# Altium project BMS_rev3.PrjPCB (part 1 of 3)
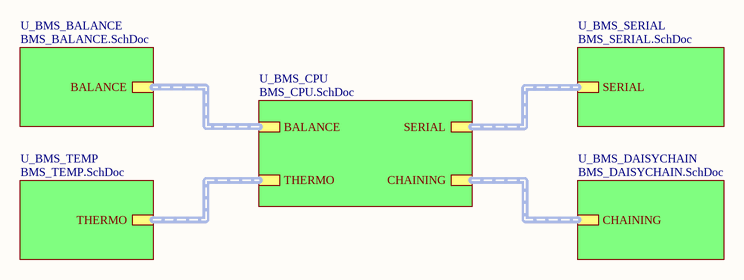
[diagram p0: BMS_REV3.SchDoc]
7 sheets, 203 parts. Net scope: hierarchical (ports join the sheet entries above them; power ports are global).
Board file: PCB_REV3.PcbDoc
Sheets:
  BMS_REV3.SchDoc
    U_BMS_BALANCE = BMS_BALANCE.SchDoc
      8 = BMS_VSNS.SchDoc
      7 = BMS_VSNS.SchDoc
      6 = BMS_VSNS.SchDoc
      5 = BMS_VSNS.SchDoc
      4 = BMS_VSNS.SchDoc
      3 = BMS_VSNS.SchDoc
      2 = BMS_VSNS.SchDoc
      1 = BMS_VSNS.SchDoc
      9 = BMS_VSNS.SchDoc
      11 = BMS_VSNS.SchDoc
      10 = BMS_VSNS.SchDoc
      12 = BMS_VSNS.SchDoc
    U_BMS_CPU = BMS_CPU.SchDoc
    U_BMS_DAISYCHAIN = BMS_DAISYCHAIN.SchDoc
    U_BMS_TEMP = BMS_TEMP.SchDoc
    U_BMS_SERIAL = BMS_SERIAL.SchDoc

## Sheet BMS_REV3.SchDoc
size B; Organization: Altium Limited; Address1: L3, 12a Rodborough Rd; Address2: Frenchs Forest; Address3: NSW; Address4: Australia 2086

### Sub-sheets
U_BMS_BALANCE = BMS_BALANCE.SchDoc: BALANCE (harness BALANCE)
U_BMS_CPU = BMS_CPU.SchDoc: SERIAL (harness SERIAL), CHAINING (harness CHAINING), THERMO (harness THERMO), BALANCE (harness BALANCE)
U_BMS_DAISYCHAIN = BMS_DAISYCHAIN.SchDoc: CHAINING (harness CHAINING)
U_BMS_SERIAL = BMS_SERIAL.SchDoc: SERIAL (harness SERIAL)
U_BMS_TEMP = BMS_TEMP.SchDoc: THERMO (harness THERMO)

### Buses and harness runs
harness sheet U_BMS_BALANCE/BALANCE = sheet U_BMS_CPU/BALANCE
harness sheet U_BMS_CPU/CHAINING = sheet U_BMS_DAISYCHAIN/CHAINING
harness sheet U_BMS_CPU/SERIAL = sheet U_BMS_SERIAL/SERIAL
harness sheet U_BMS_CPU/THERMO = sheet U_BMS_TEMP/THERMO

### Notes on the sheet
- Title
- Size:
- Date:
- Tabloid
- Number:
- Time:
- Revision:
- Sheet
- of
- File:

## Sheet BMS_BALANCE.SchDoc
size B; Organization: Altium Limited; Address1: L3, 12a Rodborough Rd; Address2: Frenchs Forest; Address3: NSW; Address4: Australia 2086
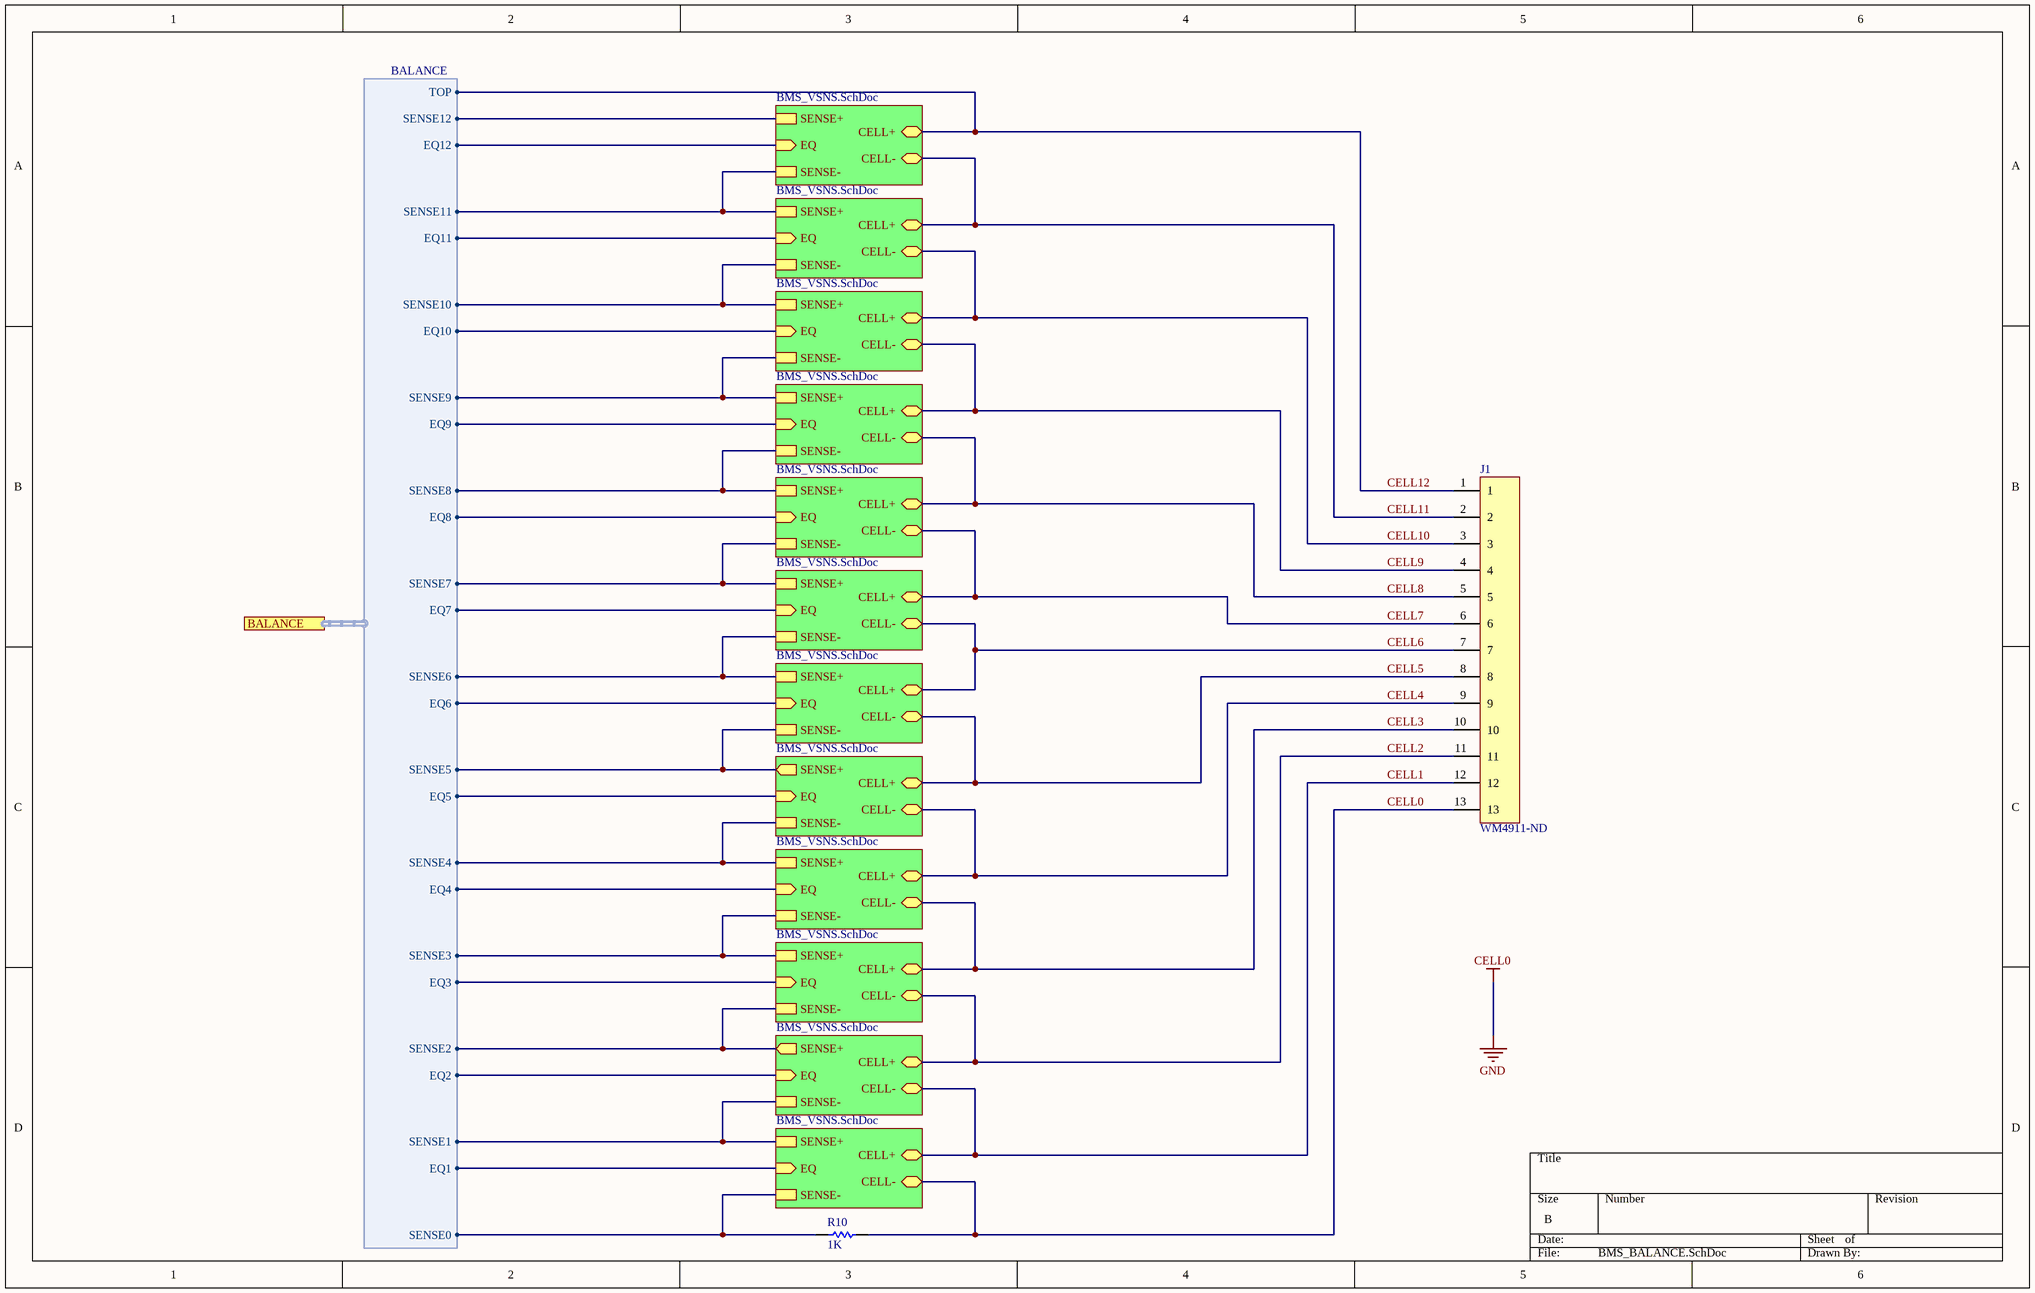
[diagram p1: BMS_BALANCE.SchDoc]

### Parts
J1  WM4911-ND  [13PIN]
R10  1K  [RES-0603]

### Sub-sheets
1 = BMS_VSNS.SchDoc: EQ (in), SENSE+, SENSE-, CELL+ (bidir), CELL- (bidir)
2 = BMS_VSNS.SchDoc: EQ (in), SENSE+ (out), SENSE-, CELL+ (bidir), CELL- (bidir)
3 = BMS_VSNS.SchDoc: EQ (in), SENSE+, SENSE-, CELL+ (bidir), CELL- (bidir)
4 = BMS_VSNS.SchDoc: EQ (in), SENSE+, SENSE-, CELL+ (bidir), CELL- (bidir)
5 = BMS_VSNS.SchDoc: EQ (in), SENSE+ (out), SENSE-, CELL+ (bidir), CELL- (bidir)
6 = BMS_VSNS.SchDoc: EQ (in), SENSE+, SENSE-, CELL+ (bidir), CELL- (bidir)
7 = BMS_VSNS.SchDoc: EQ (in), SENSE+, SENSE-, CELL+ (bidir), CELL- (bidir)
8 = BMS_VSNS.SchDoc: EQ (in), SENSE+, SENSE-, CELL+ (bidir), CELL- (bidir)
9 = BMS_VSNS.SchDoc: EQ (in), SENSE+, SENSE-, CELL+ (bidir), CELL- (bidir)
10 = BMS_VSNS.SchDoc: EQ (in), SENSE+, SENSE-, CELL+ (bidir), CELL- (bidir)
11 = BMS_VSNS.SchDoc: EQ (in), SENSE+, SENSE-, CELL+ (bidir), CELL- (bidir)
12 = BMS_VSNS.SchDoc: EQ (in), SENSE+, SENSE-, CELL+ (bidir), CELL- (bidir)

### Ports
BALANCE (harness BALANCE)

### Harnesses
BALANCE: EQ6, SENSE6, EQ7, SENSE7, EQ8, SENSE8, EQ9, SENSE9, SENSE5, EQ5, SENSE4, EQ4, SENSE3, EQ3, SENSE2, EQ2, SENSE1, EQ1, SENSE0, SENSE10, EQ10, TOP, EQ11, SENSE11, SENSE12, EQ12

### Nets
CELL0: J1.13 R10.2 ; sheet 1/CELL-  [also labelled GND]
CELL1: J1.12 ; sheet 2/CELL-, sheet 1/CELL+
CELL2: J1.11 ; sheet 3/CELL-, sheet 2/CELL+
CELL3: J1.10 ; sheet 4/CELL-, sheet 3/CELL+
CELL4: J1.9 ; sheet 5/CELL-, sheet 4/CELL+
CELL5: J1.8 ; sheet 6/CELL-, sheet 5/CELL+
CELL6: J1.7 ; sheet 7/CELL-, sheet 6/CELL+
CELL7: J1.6 ; sheet 8/CELL-, sheet 7/CELL+
CELL8: J1.5 ; sheet 8/CELL+, sheet 9/CELL-
CELL9: J1.4 ; sheet 9/CELL+, sheet 10/CELL-
CELL10: J1.3 ; sheet 11/CELL-, sheet 10/CELL+
CELL11: J1.2 ; sheet 11/CELL+, sheet 12/CELL-
CELL12: J1.1 ; sheet 12/CELL+, port BALANCE.TOP
EQ-1: sheet 1/EQ, port BALANCE.EQ1
EQ-2: sheet 2/EQ, port BALANCE.EQ2
EQ-3: sheet 3/EQ, port BALANCE.EQ3
EQ-4: sheet 4/EQ, port BALANCE.EQ4
EQ-5: sheet 5/EQ, port BALANCE.EQ5
EQ-6: sheet 6/EQ, port BALANCE.EQ6
EQ-7: sheet 7/EQ, port BALANCE.EQ7
EQ-8: sheet 8/EQ, port BALANCE.EQ8
EQ-9: sheet 9/EQ, port BALANCE.EQ9
EQ-10: sheet 10/EQ, port BALANCE.EQ10
EQ-11: sheet 11/EQ, port BALANCE.EQ11
EQ-12: sheet 12/EQ, port BALANCE.EQ12
VSNS0: R10.1 ; sheet 1/SENSE-, port BALANCE.SENSE0
VSNS1: sheet 2/SENSE-, sheet 1/SENSE+, port BALANCE.SENSE1
VSNS2: sheet 3/SENSE-, sheet 2/SENSE+, port BALANCE.SENSE2
VSNS3: sheet 4/SENSE-, sheet 3/SENSE+, port BALANCE.SENSE3
VSNS4: sheet 5/SENSE-, sheet 4/SENSE+, port BALANCE.SENSE4
VSNS5: sheet 6/SENSE-, sheet 5/SENSE+, port BALANCE.SENSE5
VSNS6: sheet 7/SENSE-, sheet 6/SENSE+, port BALANCE.SENSE6
VSNS7: sheet 8/SENSE-, sheet 7/SENSE+, port BALANCE.SENSE7
VSNS8: sheet 8/SENSE+, sheet 9/SENSE-, port BALANCE.SENSE8
VSNS9: sheet 9/SENSE+, sheet 10/SENSE-, port BALANCE.SENSE9
VSNS10: sheet 11/SENSE-, sheet 10/SENSE+, port BALANCE.SENSE10
VSNS11: sheet 11/SENSE+, sheet 12/SENSE-, port BALANCE.SENSE11
VSNS12: sheet 12/SENSE+, port BALANCE.SENSE12

### Notes on the sheet
- Title
- Size:
- Date:
- Tabloid
- Number:
- Time:
- Revision:
- Sheet
- of
- File:

### Library data of the parts
J1 = 13PIN: CONN HEADER R/A 13POS 2.54MM; Manufacturer: Molex; Manufacturer Part Number: 0705530012; Contact Resistance: 30mR; Number of Positions: 13; Gender: Male; Connector Type: Male Pin; Pitch: 0.1inch; Supplier 1: Digi-Key; Stock 1: 22; Pricing 1: 1=6.09, 10=5.355, 100=4.2597, 1000=3.52944 (USD); Mount: Through Hole; Contact Material: Bronze; Contact Plating: Gold; Housing Color: Black; Housing Material: Polyester; Color: Black; Min Operating Temperature: -40°C; Max Operating Temperature: 105°C; Package Quantity: 1; Packaging: Rail/Tube; Number of Rows: 1; Termination: Solder; Orientation: Right Angle; Length: 35.57mm; Contact Mating Length: 0.24inch; Depth: 13.59mm; Supplier Part Number 1: WM4911-ND
R10 = 0603-1KR: RES SMD 1K OHM 1% 1/10W 0603; Manufacturer: Vishay Dale; Manufacturer Part Number: CRCW06031K00FKEA; Resistance: 1kR; Power Rating: 100mW; Voltage Rating: 75V; Temperature Coefficient: 100ppm/°C; Supplier 1: Digi-Key; Stock 1: 671453; Pricing 1: 1=0.1, 10=0.034, 100=0.0139, 1000=0.00623, 2500=0.0054 (USD); Mount: Surface Mount; Case/Package: 0603; Number of Pins: 2; Weight: 7.1E-05oz; Case Code (Metric): 1608; Case Code (Imperial): 0603; Contact Plating: Tin; Min Operating Temperature: -55°C; Max Operating Temperature: 155°C; Composition: Thick Film; Tolerance: 1%; Packaging: Tape and Reel; Package Quantity: 10; Number of Terminations: 2; Termination: SMD/SMT; Military Standard: Not; Max Power Dissipation: 100mW; Voltage Rating (DC): 75V; Features: Automotive AEC-Q200; Length: 1.55mm; Height: 0.45mm; Width: 0.033inch; Depth: 0.85mm; Radiation Hardening: No; REACH SVHC: Unknown; Lead Free: Lead Free; ComponentLink1URL: http://www.vishay.com/docs/20035/dcrcwe3.pdf?src-supplier=Digi-Key; ComponentLink1Description: http://www.vishay.com/docs/20035/dcrcwe3.pdf?src-supplier=Digi-Key; ComponentLink2URL: http://uk.rs-online.com/webdocs/0d98/0900766b80d98afc.pdf?src-supplier=RSComponents; ComponentLink2Description: http://uk.rs-online.com/webdocs/0d98/0900766b80d98afc.pdf?src-supplier=RSComponents; ComponentLink3URL: http://www.vishay.com/docs/20035/dcrcwe3.pdf?src-supplier=Avnet; ComponentLink3Description: http://www.vishay.com/docs/20035/dcrcwe3.pdf?src-supplier=Avnet; ComponentLink4URL: http://www.vishay.com/docs/20035/dcrcwe3.pdf?src-supplier=Avnet+Asia; ComponentLink4Description: http://www.vishay.com/docs/20035/dcrcwe3.pdf?src-supplier=Avnet+Asia; ComponentLink5URL: http://www.farnell.com/datasheets/2310790.pdf?src-supplier=Element14; ComponentLink5Description: http://www.farnell.com/datasheets/2310790.pdf?src-supplier=Element14; ComponentLink6URL: https://www.distrelec.biz/Web/Downloads/a_/en/flD-CRCW-e3_data_en.pdf?mime=application%2Fpdf&src-supplier=Distrelec; ComponentLink6Description: https://www.distrelec.biz/Web/Downloads/a_/en/flD-CRCW-e3_data_en.pdf?mime=application%2Fpdf&src-supplier=Distrelec; ComponentLink7URL: http://www.vishay.com/docs/20035/dcrcwe3.pdf?src-supplier=Future+Electronics; ComponentLink7Description: http://www.vishay.com/docs/20035/dcrcwe3.pdf?src-supplier=Future+Electronics; ComponentLink8URL: http://www.vishay.com/docs/20035/dcrcwe3.pdf?src-supplier=Avnet+Europe; ComponentLink8Description: http://www.vishay.com/docs/20035/dcrcwe3.pdf?src-supplier=Avnet+Europe; Supplier Part Number 1: 541-1.00KHCT-ND

## Sheet BMS_VSNS.SchDoc
size B; Organization: Altium Limited; Address1: L3, 12a Rodborough Rd; Address2: Frenchs Forest; Address3: NSW; Address4: Australia 2086
Used 12 times, as channels U_BMS_BALANCE/8, U_BMS_BALANCE/7, U_BMS_BALANCE/6, U_BMS_BALANCE/5, U_BMS_BALANCE/4, U_BMS_BALANCE/3, U_BMS_BALANCE/2, U_BMS_BALANCE/1, U_BMS_BALANCE/9, U_BMS_BALANCE/11, U_BMS_BALANCE/10, U_BMS_BALANCE/12. Parts and nets are listed once, with the designators drawn on the sheet.
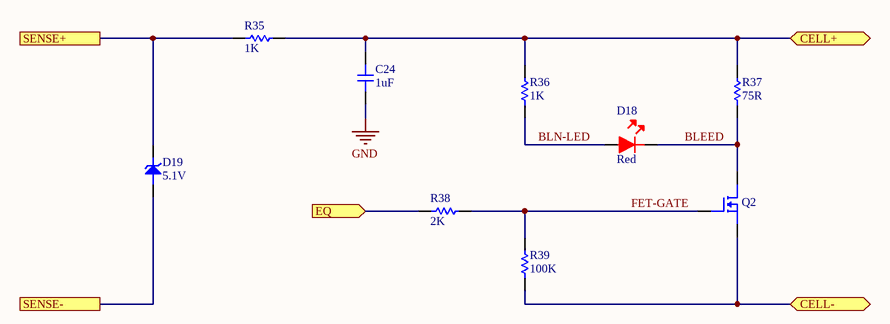
[diagram p2: BMS_VSNS.SchDoc]

### Parts
C24  1uF  [CAP-0603]
D18  Red  [LED-0603]
D19  5.1V  [DIODE-SOD123]
Q2  DMN6140L-13DICT-ND  [SOT-23-3]  (value not drawn)
R35  1K  [RES-0603]
R36  1K  [RES-0603]
R37  75R  [RES-2512]
R38  2K  [RES-0603]
R39  100K  [RES-0603]

### Ports
CELL+ (bidir), CELL- (bidir), EQ (in), SENSE+, SENSE-

### Nets
GND: C24.1
BLEED: D18.2 Q2.2 R37.1
BLN-LED: D18.1 R36.1
CELL+: C24.2 R35.2 R36.2 R37.2 ; port CELL+
CELL-: Q2.3 R39.1 ; port CELL-
EQ: R38.1 ; port EQ
FET-GATE: Q2.1 R38.2 R39.2
SENSE+: D19.1 R35.1 ; port SENSE+
SENSE-: D19.2 ; port SENSE-

### Channels
U_BMS_BALANCE/8: designators end in _8; ports CELL+=CELL8 CELL-=CELL7 EQ=EQ-8 SENSE+=VSNS8 SENSE-=VSNS7
U_BMS_BALANCE/7: designators end in _7; ports CELL+=CELL7 CELL-=CELL6 EQ=EQ-7 SENSE+=VSNS7 SENSE-=VSNS6
U_BMS_BALANCE/6: designators end in _6; ports CELL+=CELL6 CELL-=CELL5 EQ=EQ-6 SENSE+=VSNS6 SENSE-=VSNS5
U_BMS_BALANCE/5: designators end in _5; ports CELL+=CELL5 CELL-=CELL4 EQ=EQ-5 SENSE+=VSNS5 SENSE-=VSNS4
U_BMS_BALANCE/4: designators end in _4; ports CELL+=CELL4 CELL-=CELL3 EQ=EQ-4 SENSE+=VSNS4 SENSE-=VSNS3
U_BMS_BALANCE/3: designators end in _3; ports CELL+=CELL3 CELL-=CELL2 EQ=EQ-3 SENSE+=VSNS3 SENSE-=VSNS2
U_BMS_BALANCE/2: designators end in _2; ports CELL+=CELL2 CELL-=CELL1 EQ=EQ-2 SENSE+=VSNS2 SENSE-=VSNS1
U_BMS_BALANCE/1: designators end in _1; ports CELL+=CELL1 CELL-=CELL0 EQ=EQ-1 SENSE+=VSNS1 SENSE-=VSNS0
U_BMS_BALANCE/9: designators end in _9; ports CELL+=CELL9 CELL-=CELL8 EQ=EQ-9 SENSE+=VSNS9 SENSE-=VSNS8
U_BMS_BALANCE/11: designators end in _11; ports CELL+=CELL11 CELL-=CELL10 EQ=EQ-11 SENSE+=VSNS11 SENSE-=VSNS10
U_BMS_BALANCE/10: designators end in _10; ports CELL+=CELL10 CELL-=CELL9 EQ=EQ-10 SENSE+=VSNS10 SENSE-=VSNS9
U_BMS_BALANCE/12: designators end in _12; ports CELL+=CELL12 CELL-=CELL11 EQ=EQ-12 SENSE+=VSNS12 SENSE-=VSNS11

### Notes on the sheet
- Title
- Size:
- Date:
- Tabloid
- Number:
- Time:
- Revision:
- Sheet
- of
- File:

### Library data of the parts
C24 = 0603-1uF-16V: CAP CER 1UF 16V X7R 0603; Manufacturer: KEMET; Manufacturer Part Number: C0603C105K4RACTU; Dielectric Material: Ceramic; Tolerance: 10%; Dissipation Factor: 3.5%; Supplier 1: Digi-Key; Stock 1: 600463; Pricing 1: 1=0.12, 10=0.088, 100=0.0391, 500=0.02792, 1000=0.02193 (USD); Mount: Surface Mount,PCB; Case/Package: 0603; Number of Pins: 2; Case Code (Metric): 1608; Case Code (Imperial): 0603; Contact Plating: Tin,Matte; Min Operating Temperature: -55°C; Max Operating Temperature: 125°C; Package Quantity: 4000; Capacitance: 1uF; Voltage Rating: 16V; Packaging: Tape and Reel; Voltage Rating (DC): 16V; Dielectric: X7R; Termination: SMD/SMT; Voltage: 16V; Length: 1.6mm; Height: 0.8mm; Width: 0.031inch; Thickness: 0.034inch; Depth: 0.8mm; Radiation Hardening: No; REACH SVHC: No SVHC; ComponentLink1URL: http://www.mouser.com/ds/2/212/KEM_C1002_X7R_SMD-1102033.pdf?src-supplier=Mouser; ComponentLink1Description: http://www.mouser.com/ds/2/212/KEM_C1002_X7R_SMD-1102033.pdf?src-supplier=Mouser; ComponentLink2URL: http://www.kemet.com/kemet/web/homepage/kechome.nsf/file/Commercial%20Ceramic%20Chips%20X7R%20Dielectric/$file/KEM_C1002_X7R_SMD.pdf?src-supplier=Element14; ComponentLink2Description: http://www.kemet.com/kemet/web/homepage/kechome.nsf/file/Commercial%20Ceramic%20Chips%20X7R%20Dielectric/$file/KEM_C1002_X7R_SMD.pdf?src-supplier=Element14; ComponentLink3URL: https://www.verical.com/server-webapp/html/getDatasheet?partID=385479&src-supplier=Verical; ComponentLink3Description: https://www.verical.com/server-webapp/html/getDatasheet?partID=385479&src-supplier=Verical; ComponentLink4URL: http://www.kemet.com/kemet/web/homepage/kechome.nsf/vapubfiles/KEM_C1002_X7R_SMD.pdf/$file/KEM_C1002_X7R_SMD.pdf?src-supplier=Element14; ComponentLink4Description: http://www.kemet.com/kemet/web/homepage/kechome.nsf/vapubfiles/KEM_C1002_X7R_SMD.pdf/$file/KEM_C1002_X7R_SMD.pdf?src-supplier=Element14; Supplier Part Number 1: 399-7847-6-ND
D18 = LED-Red: LED RED CLEAR 0603 SMD; Manufacturer: Wurth Electronics; Manufacturer Part Number: 150060RS75000; Viewing Angle: 140°; Lens Style: Clear,Rectangular; Luminous Intensity: 250mcd; Forward Current: 30mA; Forward Voltage: 2V; Wavelength: 625nm; Test Current: 20mA; Supplier 1: Digi-Key; Stock 1: 18518; Pricing 1: 1=0.14, 50=0.133, 100=0.114, 500=0.099 (USD); Mount: Surface Mount; Case/Package: 0603; Color: Red; Case Code (Metric): 1608; Case Code (Imperial): 0603; Min Operating Temperature: -40°C; Max Operating Temperature: 85°C; Package Quantity: 1; Packaging: Cut Tape; Dominant Wavelength: 625nm; Length: 1.6mm; Height: 0.7mm; Width: 0.8mm; REACH SVHC: Unknown; ComponentLink1URL: https://katalog.we-online.de/led/datasheet/150060RS75000.pdf?src-supplier=Digi-Key; ComponentLink1Description: https://katalog.we-online.de/led/datasheet/150060RS75000.pdf?src-supplier=Digi-Key; ComponentLink2URL: http://www.produktinfo.conrad.com/datenblaetter/750000-774999/759428-da-01-en-CHIPLED_0603_W_KL_ROT_150060RS75000.pdf?src-supplier=Conrad; ComponentLink2Description: http://www.produktinfo.conrad.com/datenblaetter/750000-774999/759428-da-01-en-CHIPLED_0603_W_KL_ROT_150060RS75000.pdf?src-supplier=Conrad; Supplier Part Number 1: 732-4978-6-ND
D19 = Zener-5.1V-0.5W: DIODE ZENER 5.1V 500MW SOD123; Manufacturer: MCC; Manufacturer Part Number: MMSZ4689-TP; Tolerance: 5%; Max Reverse Leakage Current: 10uA; Test Current: 50uA; Element Configuration: Single; Supplier 1: Digi-Key; Stock 1: 77807; Pricing 1: 1=0.2, 10=0.161, 25=0.1352, 100=0.066, 250=0.06496, 500=0.05506, 1000=0.03825 (USD); Mount: Surface Mount; Number of Pins: 2; Min Operating Temperature: -55°C; Max Operating Temperature: 150°C; Package Quantity: 3000; Packaging: Tape and Reel; Zener Voltage: 5.1V; Max Power Dissipation: 500mW; Voltage Tolerance: 5%; Power Dissipation: 500mW; Zener Current: 50uA; Lead Free: Lead Free; ComponentLink1URL: http://www.mccsemi.com/up_pdf/MMSZ4678-MMSZ4716(SOD-123)-D.pdf?src-supplier=Digi-Key; ComponentLink1Description: http://www.mccsemi.com/up_pdf/MMSZ4678-MMSZ4716(SOD-123)-D.pdf?src-supplier=Digi-Key; Supplier Part Number 1: MMSZ4689-TPMSDKR-ND
Q2 = N-FET-60V-1.6A: MOSFET N-CH 60V 1.6A SOT23; Manufacturer: Diodes; Rds On Max: 140mR; Input Capacitance: 315pF; Max Power Dissipation: 700mW; Supplier 1: Digi-Key; Manufacturer Part Number: DMN6140L-13; Stock 1: 274948; Pricing 1: 1=0.34, 10=0.256, 25=0.224, 100=0.1217, 250=0.12104, 500=0.09926, 1000=0.07365, 2500=0.06468, 5000=0.05924 (USD); Mount: Surface Mount; Case/Package: TO-236-3; Min Operating Temperature: -55°C; Max Operating Temperature: 150°C; Package Quantity: 10000; Packaging: Cut Tape; Drain to Source Voltage (Vdss): 60V; Continuous Drain Current (ID): 1.6A; ComponentLink1URL: https://www.diodes.com/assets/Datasheets/DMN6140L.pdf?src-supplier=Digi-Key; ComponentLink1Description: https://www.diodes.com/assets/Datasheets/DMN6140L.pdf?src-supplier=Digi-Key; Supplier Part Number 1: DMN6140L-13DIDKR-ND
R35 R36 = 0603-1KR: as R10 on sheet BMS_BALANCE; Supplier 1: Digi-Key; Stock 1: 671453; Pricing 1: 1=0.1, 10=0.034, 100=0.0139, 1000=0.00623, 2500=0.0054 (USD); Mount: Surface Mount; Case/Package: 0603; Number of Pins: 2; Weight: 7.1E-05oz; Case Code (Metric): 1608; Case Code (Imperial): 0603; Contact Plating: Tin; Min Operating Temperature: -55°C; Max Operating Temperature: 155°C; Composition: Thick Film; Tolerance: 1%; Packaging: Tape and Reel; Package Quantity: 10; Number of Terminations: 2; Termination: SMD/SMT; Military Standard: Not; Max Power Dissipation: 100mW; Voltage Rating (DC): 75V; Features: Automotive AEC-Q200; Length: 1.55mm; Height: 0.45mm; Width: 0.033inch; Depth: 0.85mm; Radiation Hardening: No; REACH SVHC: Unknown; Lead Free: Lead Free; ComponentLink1URL: http://www.vishay.com/docs/20035/dcrcwe3.pdf?src-supplier=Digi-Key; ComponentLink1Description: http://www.vishay.com/docs/20035/dcrcwe3.pdf?src-supplier=Digi-Key; ComponentLink2URL: http://uk.rs-online.com/webdocs/0d98/0900766b80d98afc.pdf?src-supplier=RSComponents; ComponentLink2Description: http://uk.rs-online.com/webdocs/0d98/0900766b80d98afc.pdf?src-supplier=RSComponents; ComponentLink3URL: http://www.vishay.com/docs/20035/dcrcwe3.pdf?src-supplier=Avnet; ComponentLink3Description: http://www.vishay.com/docs/20035/dcrcwe3.pdf?src-supplier=Avnet; ComponentLink4URL: http://www.vishay.com/docs/20035/dcrcwe3.pdf?src-supplier=Avnet+Asia; ComponentLink4Description: http://www.vishay.com/docs/20035/dcrcwe3.pdf?src-supplier=Avnet+Asia; ComponentLink5URL: http://www.farnell.com/datasheets/2310790.pdf?src-supplier=Element14; ComponentLink5Description: http://www.farnell.com/datasheets/2310790.pdf?src-supplier=Element14; ComponentLink6URL: https://www.distrelec.biz/Web/Downloads/a_/en/flD-CRCW-e3_data_en.pdf?mime=application%2Fpdf&src-supplier=Distrelec; ComponentLink6Description: https://www.distrelec.biz/Web/Downloads/a_/en/flD-CRCW-e3_data_en.pdf?mime=application%2Fpdf&src-supplier=Distrelec; ComponentLink7URL: http://www.vishay.com/docs/20035/dcrcwe3.pdf?src-supplier=Future+Electronics; ComponentLink7Description: http://www.vishay.com/docs/20035/dcrcwe3.pdf?src-supplier=Future+Electronics; ComponentLink8URL: http://www.vishay.com/docs/20035/dcrcwe3.pdf?src-supplier=Avnet+Europe; ComponentLink8Description: http://www.vishay.com/docs/20035/dcrcwe3.pdf?src-supplier=Avnet+Europe; Supplier Part Number 1: 541-1.00KHCT-ND
R37 = 2512-75R: RES 75 OHM 1% 1W 2512; Manufacturer: Stackpole Electronics; Manufacturer Part Number: RMCF2512FT75R0; Temperature Coefficient: 100ppm/°C; Supplier 1: Digi-Key; Stock 1: 20865; Pricing 1: 1=0.36, 10=0.303, 100=0.1183, 1000=0.0495 (USD); Mount: Surface Mount; Case/Package: 2512; Contact Plating: Tin,Matte; Min Operating Temperature: -55°C; Max Operating Temperature: 155°C; Packaging: Tape and Reel; Resistance: 75R; Tolerance: 1%; Power Rating: 1W; Composition: Thick Film; Package Quantity: 4000; Number of Terminations: 2; Max Power Dissipation: 1W; Features: Automotive AEC-Q200; Length: 0.248inch; Height: 0.028inch; Width: 0.126inch; Radiation Hardening: No; ComponentLink1URL: https://www.seielect.com/catalog/sei-rmcf_rmcp.pdf?src-supplier=Digi-Key; ComponentLink1Description: https://www.seielect.com/catalog/sei-rmcf_rmcp.pdf?src-supplier=Digi-Key; ComponentLink2URL: https://www.seielect.com/catalog/SEI-RMCF_RMCP.pdf?src-supplier=Avnet; ComponentLink2Description: https://www.seielect.com/catalog/SEI-RMCF_RMCP.pdf?src-supplier=Avnet; Supplier Part Number 1: RMCF2512FT75R0DKR-ND
R38 = 0603-2KR: RES SMD 2K OHM 1% 1/4W 0603; Manufacturer: Vishay Dale; Manufacturer Part Number: CRCW06032K00FKEAHP; Resistance: 2kR; Power Rating: 250mW; Voltage Rating: 75V; Temperature Coefficient: 100ppm/°C; Supplier 1: Digi-Key; Stock 1: 23723; Pricing 1: 1=0.17, 10=0.142, 100=0.0553, 1000=0.02317, 2500=0.02124 (USD); Mount: Surface Mount; Case/Package: 0603; Weight: 7.1E-05oz; Case Code (Metric): 1608; Case Code (Imperial): 0603; Contact Plating: Tin; Min Operating Temperature: -55°C; Max Operating Temperature: 155°C; Package Quantity: 10; Tolerance: 1%; Packaging: Tape and Reel; Composition: Thick Film; Number of Terminations: 2; Termination: Solder; Max Power Dissipation: 250mW; Features: Automotive AEC-Q200; Military Standard: Not; Length: 1.6mm; Height: 0.45mm; Width: 0.033inch; Depth: 0.85mm; Radiation Hardening: No; Lead Free: Lead Free; ComponentLink1URL: http://www.vishay.com/docs/20043/crcwhpe3.pdf?src-supplier=Digi-Key; ComponentLink1Description: http://www.vishay.com/docs/20043/crcwhpe3.pdf?src-supplier=Digi-Key; Supplier Part Number 1: 541-2.00KSDKR-ND
R39 = 0603-100KR: RES 100K OHM 1% 1/10W 0603; Manufacturer: Stackpole Electronics; Manufacturer Part Number: RMCF0603FT100K; Resistance: 100kR; Power Rating: 100mW; Temperature Coefficient: 100ppm/°C; Working Voltage: 75V; Supplier 1: Digi-Key; Stock 1: 1428218; Pricing 1: 1=0.1, 10=0.016, 100=0.0065, 1000=0.00292, 2500=0.00253 (USD); Mount: Surface Mount; Case/Package: 0603; Case Code (Metric): 1608; Case Code (Imperial): 0603; Contact Plating: Tin,Matte; Min Operating Temperature: -55°C; Max Operating Temperature: 155°C; Packaging: Tape and Reel; Tolerance: 1%; Composition: Thick Film; Number of Terminations: 2; Military Standard: Not; Max Power Dissipation: 100mW; Features: Automotive AEC-Q200; Length: 1.55mm; Height: 0.022inch; Width: 0.031inch; Depth: 0.8mm; Radiation Hardening: No; Lead Free: Lead Free; ComponentLink1URL: https://www.verical.com/server-webapp/html/getDatasheet?partID=362597&src-supplier=Verical; ComponentLink1Description: https://www.verical.com/server-webapp/html/getDatasheet?partID=362597&src-supplier=Verical; Supplier Part Number 1: RMCF0603FT100KDKR-ND